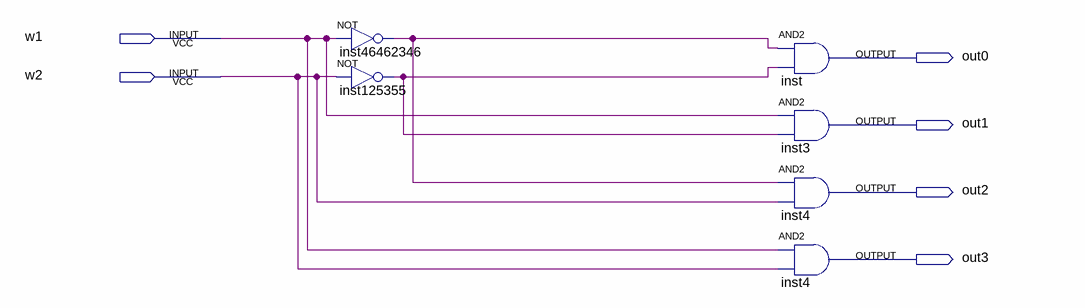
[diagram p0: schematic sheet]
// Quartus schematic dec_2to4.bdf as structural Verilog: 6 symbols, 6 pins
module dec_2to4 (
  input  w1,
  input  w2,
  output out0,
  output out1,
  output out2,
  output out3
);

  wire inst125355_out, inst46462346_out;

  not inst46462346 (inst46462346_out, w1);
  not inst125355 (inst125355_out, w2);
  and inst (out0, inst46462346_out, inst125355_out);
  and inst3 (out1, w1, inst125355_out);
  and inst4 (out2, inst46462346_out, w2);
  and inst4_dup2 (out3, w1, w2);
endmodule
